# EAGLE design Eingangsplatine_reve_2layer (EAGLE 5.11)
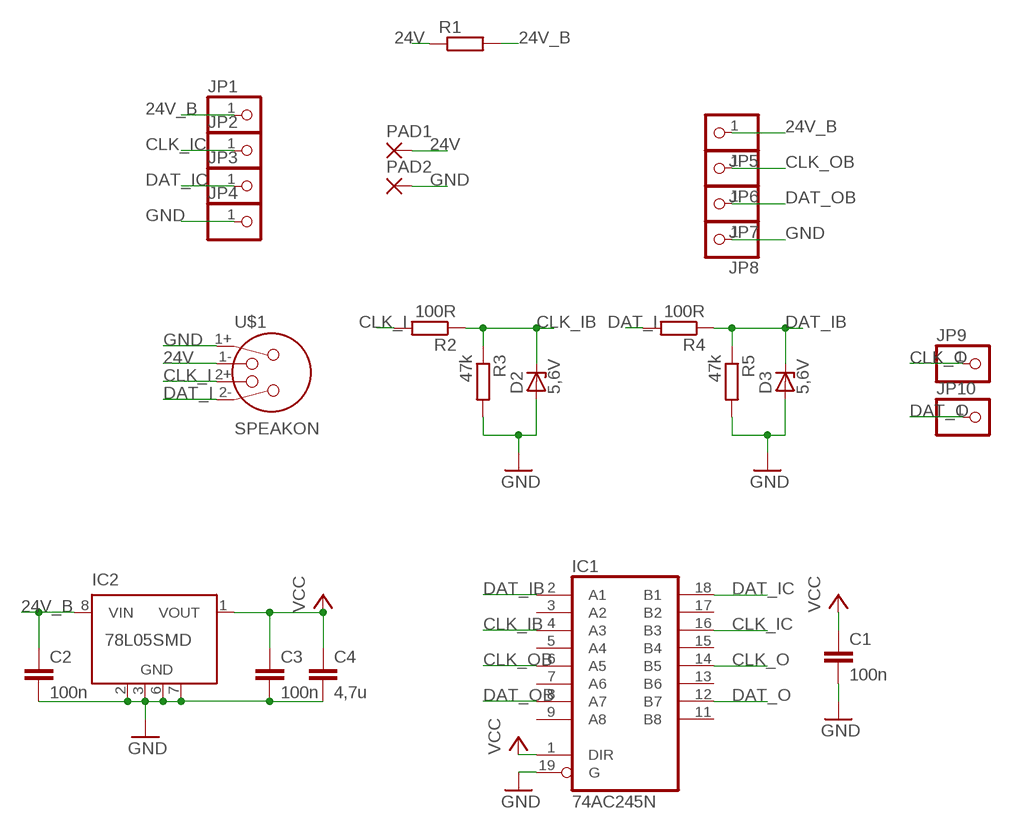
[diagram p0: schematic, sheet 1]

## Parts
C1  100n  C-EUC0805  [C0805]
C2  100n  C-EUC0805  [C0805]
C3  100n  C-EUC0805  [C0805]
C4  4,7u  C-EUC1206  [C1206]
D2  5,6V  ZENER-DIODESOD80C  [SOD80C]
D3  5,6V  ZENER-DIODESOD80C  [SOD80C]
IC1  74AC245N  [DIL20]
IC2  78L05SMD  [SO08]
JP1  PINHD-1X1  [1X01]
JP2  PINHD-1X1  [1X01]
JP3  PINHD-1X1  [1X01]
JP4  PINHD-1X1  [1X01]
JP5  PINHD-1X1  [1X01]
JP6  PINHD-1X1  [1X01]
JP7  PINHD-1X1  [1X01]
JP8  PINHD-1X1  [1X01]
JP9  PINHD-1X1  [1X01]
JP10  PINHD-1X1  [1X01]
PAD1  SMD5  [SMD2,54-5,08]
PAD2  SMD5  [SMD2,54-5,08]
R1  R-EU_R5025  [R5025]
R2  100R  R-EU_R0805  [R0805]
R3  47k  R-EU_R0805  [R0805]
R4  100R  R-EU_R0805  [R0805]
R5  47k  R-EU_R0805  [R0805]
U$1  SPEAKON  [SPEAKON]

## Nets
24V: PAD1.1(P) R1.1 U$1.1-
24V_B: C2.1 IC2.8(VIN) JP1.1 JP5.1 R1.2
CLK_I: R2.2 U$1.2+
CLK_IB: D2.C IC1.4(A3) R2.1 R3.1
CLK_IC: IC1.16(B3) JP2.1
CLK_O: IC1.14(B5) JP9.1
CLK_OB: IC1.6(A5) JP6.1
DAT_I: R4.2 U$1.2-
DAT_IB: D3.C IC1.2(A1) R4.1 R5.1
DAT_IC: IC1.18(B1) JP3.1
DAT_O: IC1.12(B7) JP10.1
DAT_OB: IC1.8(A7) JP7.1
GND: C1.2 C2.2 C3.2 C4.2 D2.A D3.A IC1.19(G) IC2.2(GND) IC2.3(GND) IC2.6(GND) IC2.7(GND) JP4.1 JP8.1 PAD2.1(P) R3.2 R5.2 U$1.1+
VCC: C1.1 C3.1 C4.1 IC1.1(DIR) IC2.1(VOUT)
Unconnected: IC1.3(A2) IC1.5(A4) IC1.7(A6) IC1.9(A8) IC1.11(B8) IC1.13(B6) IC1.15(B4) IC1.17(B2) IC2.4(NC) IC2.5(NC)

## Power pins joined to a net without a drawn wire
GND: IC1.10(GND)
VCC: IC1.20(VCC)

## Library data of the parts
C1-C4 = rcl:C-EU: CAPACITOR, European symbol
D2 D3 = diode:ZENER-DIODE: Z-Diode
IC1 = 74xx-eu:74*245: Octal BUS TRANSCEIVER, 3-state
IC2 = linear:78L*SMD: Positive VOLTAGE REGULATOR
JP1-JP10 = pinhead:PINHD-1X1: PIN HEADER
PAD1 PAD2 = wirepad:SMD5: SMD PAD
R1-R5 = rcl:R-EU_: RESISTOR, European symbol
U$1 = con-neutrik_ag_2bl:SPEAKON

## Board
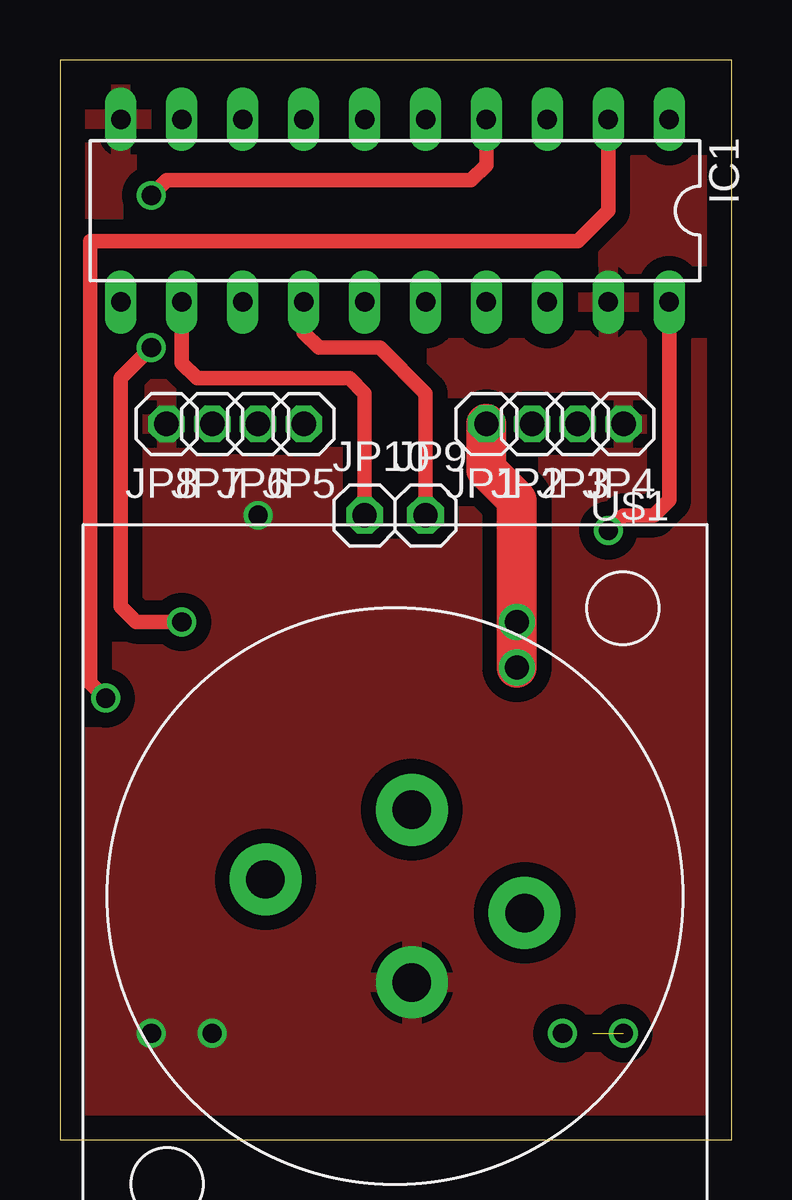
[diagram p1: board, top side]
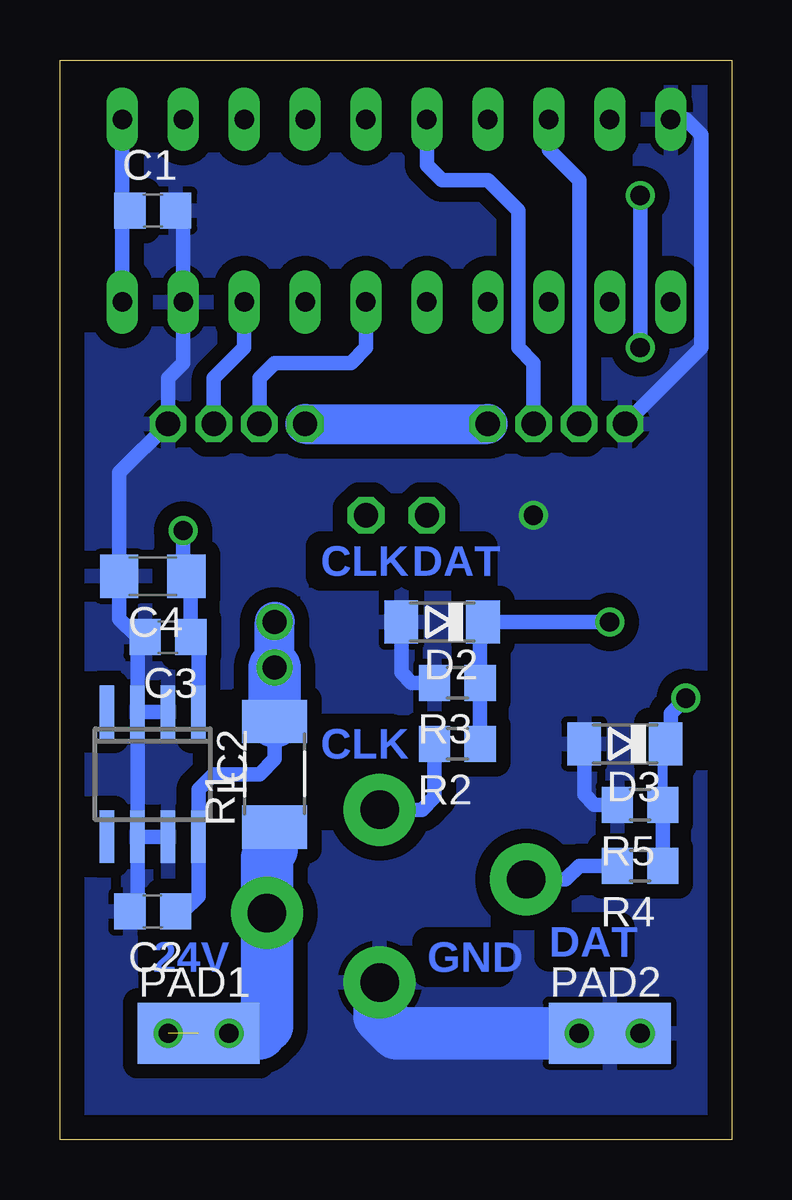
[diagram p2: board, bottom side, seen from below]

Size 28 x 45 mm. Coordinates in mm from the lower left corner, seen from the top.
Outline: 0,0 28,0 28,45 0,45 0,0
Copper layers (1*16): Top 0.035mm / dielectric 1.5mm / Bottom 0.035mm
Design rules "default": minimum track width 10mil, minimum drill 24mil, track to track 8mil, track to pad 8mil, pad to pad 8mil, via to via 8mil, smd to smd 8mil, copper to edge 40mil, drill to drill 8mil, minimum pad ring 10mil, minimum via ring 8mil, stop-mask expansion 4mil, vias tented up to drill 0mil, thermal gap 10mil

### Footprints (pad centres in the part's own frame; a part is rotated, then mirrored left to right if it is on the bottom)
C0805 = smd 1.3 x 1.5: 1 -0.95,0; 2 0.95,0
C1206 = smd 1.6 x 1.8: 1 -1.4,0; 2 1.4,0
SOD80C = smd 1.4 x 1.8: A 1.7,0; C -1.7,0
DIL20 = drill 0.813 long: 1 -11.43,-3.81; 2 -8.89,-3.81; 3 -6.35,-3.81; 4 -3.81,-3.81; 5 -1.27,-3.81; 6 1.27,-3.81; 7 3.81,-3.81; 8 6.35,-3.81; 9 8.89,-3.81; 10 11.43,-3.81; 11 11.43,3.81; 12 8.89,3.81; 13 6.35,3.81; 14 3.81,3.81; 15 1.27,3.81; 16 -1.27,3.81; 17 -3.81,3.81; 18 -6.35,3.81; 19 -8.89,3.81; 20 -11.43,3.81
SO08 = smd 0.6 x 2.2: 1 -1.905,-2.6; 2 -0.635,-2.6; 3 0.635,-2.6; 4 1.905,-2.6; 5 1.905,2.6; 6 0.635,2.6; 7 -0.635,2.6; 8 -1.905,2.6
1X01 = drill 1.016 octagon: 1 0,0
SMD2,54-5,08 = smd 2.54 x 5.08: 1 0,0
R5025 = smd 1.8 x 2.7: 1 -2.2,0; 2 2.2,0
R0805 = smd 1.3 x 1.5: 1 -0.95,0; 2 0.95,0
SPEAKON = drill 1.6 pad 3 round: 1+ -0.7,3.6; 1- -5.4,0.7; 2+ -0.7,-3.6; 2- 5.4,-0.7

### Placement (x,y rotation side)
C1  24.13,38.72 0 bottom
C2  24.13,9.51 180 bottom
C3  23.5,20.94 180 bottom
C4  24.13,23.48 180 bottom
D2  12.06,21.57 180 bottom
D3  4.45,16.5 180 bottom
IC1  13.97,38.72 180 top
IC2  24.13,15.22 180 bottom
JP1  17.78,29.83 180 top
JP2  19.68,29.83 180 top
JP3  21.59,29.83 180 top
JP4  23.5,29.83 180 top
JP5  10.16,29.83 180 top
JP6  8.26,29.83 180 top
JP7  6.35,29.83 180 top
JP8  4.45,29.83 180 top
JP9  15.24,26.02 0 top
JP10  12.7,26.02 0 top
PAD1  22.23,4.43 270 bottom
PAD2  5.08,4.43 270 bottom
R1  19.05,15.22 90 bottom
R2  11.43,16.5 180 bottom
R3  11.43,19.04 180 bottom
R4  3.81,11.41 180 bottom
R5  3.81,13.96 180 bottom
U$1  13.97,10.14 180 top

### Tracks (layer width: path | path; a pad name or v marks a point on that pad's centre or on a via)
24V  (via drill 0.8)  (1 unrouted)
  Bottom 0.406: 19.37,4.75 19.68,4.43 | 19.05,12.05 R1.1
  Bottom 1.93: 19.37,11.73 19.05,12.05
  Bottom 2.184: 19.68,4.43 v20.95,4.43 PAD1.1 | 19.37,11.73 U$1.1- 19.37,4.75
  other vias: 23.5,4.43
24V_B  (via drill 1)
  Top 1.676: JP1.1 17.78,27.93 19.05,26.66 v19.05,21.57 v19.05,19.67
  Bottom 0.61: C2.1 22.86,9.51 22.23,10.14 IC2.8 22.23,14.59 21.59,15.22 19.68,15.22 19.05,15.86 R1.2
  Bottom 1.676: JP1.1 JP5.1 | v19.05,19.67 v19.05,21.57
  Bottom 2.184: R1.2 v19.05,19.67
CLK_I
  Bottom 0.61: R2.2 12.38,14.27 12.91,13.74 U$1.2+
CLK_IB  (via drill 0.8)
  Top 0.61: IC1.4 17.78,40.62 17.14,39.99 4.45,39.99 v3.81,39.35 | v3.81,33.01 2.54,31.73 2.54,22.21 3.17,21.57 v5.08,21.57
  Bottom 0.406: R3.1 10.16,19.04 10.48,18.71 | D2.C 10.79,21.57 10.48,21.26
  Bottom 0.61: 10.48,18.71 R2.1 | 10.48,21.26 R3.1 | v5.08,21.57 D2.C | v3.81,33.01 v3.81,39.35
CLK_IC
  Bottom 0.61: IC1.16 15.24,33.01 15.88,32.37 19.05,32.37 19.68,31.73 JP2.1
CLK_O
  Top 0.61: IC1.14 10.16,33.64 10.79,33.01 13.34,33.01 15.24,31.1 JP9.1
CLK_OB
  Bottom 0.61: JP6.1 8.26,32.37 8.89,33.01 8.89,38.72 10.16,39.99 12.06,39.99 12.7,40.62 IC1.6
DAT_I
  Bottom 0.61: R4.2 6.35,11.41 6.92,10.84 U$1.2-
DAT_IB  (via drill 0.8)
  Top 0.61: v1.91,18.4 1.27,19.04 1.27,37.45 21.59,37.45 22.86,38.72 IC1.2
  Bottom 0.406: 2.86,13.63 2.54,13.96 R5.1 2.86,16.18 2.54,16.5 D3.C
  Bottom 0.61: R4.1 2.86,13.63 | 2.54,16.5 2.54,17.77 v1.91,18.4
DAT_IC
  Bottom 0.61: JP3.1 21.59,31.73 20.32,33.01 IC1.18
DAT_O
  Top 0.61: IC1.12 5.08,32.37 5.71,31.73 12.06,31.73 12.7,31.1 JP10.1
DAT_OB
  Bottom 0.61: IC1.8 7.62,41.26 6.35,39.99 JP7.1
GND  (via drill 0.8)
  Bottom 0.406: D3.A 5.71,16.5 | D2.A 13.34,21.57 | IC2.6 24.77,12.68 24.7,12.62 | IC2.2 23.5,17.77 23.55,17.82 | C2.2 24.77,9.51 | 24.77,20.3 24.13,20.94 C3.2 24.77,20.94 | C1.2 23.5,38.72 22.86,38.09
  Bottom 0.61: 24.7,12.62 IC2.7 | IC2.3 IC2.6 24.77,9.51 | IC2.3 23.55,17.82 | IC2.3 24.77,20.3 | 24.77,20.94 25.53,21.7 C4.2 25.53,27.79 JP4.1 23.5,31.73 22.86,32.37 IC1.19 22.86,38.09 | JP8.1 1.27,33.01 1.27,41.89 1.91,42.53 IC1.10 | R3.2 13.34,19.04 13.77,19.46 D2.A | R5.2 5.71,13.96 6.14,14.38 D3.A
  Bottom 2.184: PAD2.1 v6.35,4.43 13.97,4.43 14.67,5.13 U$1.1+
  other vias: 8.26,26.02 3.81,4.43
  pour Bottom (isolate 0.61): -2.54,46.98 30.48,47.52 31.75,-0.65 -1.27,-1.28
  pour Top (isolate 0.61): -1.91,46.34 31.11,46.34 31.11,-6.36 -1.91,-6.36
VCC  (via drill 0.8)
  Top 0.61: v22.86,25.38 23.5,26.02 24.77,26.02 25.4,26.66 IC1.20
  Bottom 0.406: 22.23,20.94 C3.1 | C4.1 22.86,23.48 22.55,23.16 | 25.4,39.35 24.77,38.72 C1.1 25.4,38.72
  Bottom 0.61: IC2.1 22.23,20.94 | C3.1 22.55,23.16 | 25.4,39.35 IC1.1 | IC1.20 25.4,38.72 | 22.86,23.48 v22.86,25.38

### Text on the board
Bottom: DAT | CLK | CLK | DAT | GND | 24V